# EasyEDA schematic speed_truck.json
TITLE: speed_truck; REV: 1.0; Date: 2022-02-19; Sheet: 1/1; Drawn By: Norman Karas; Company: CRISTAL
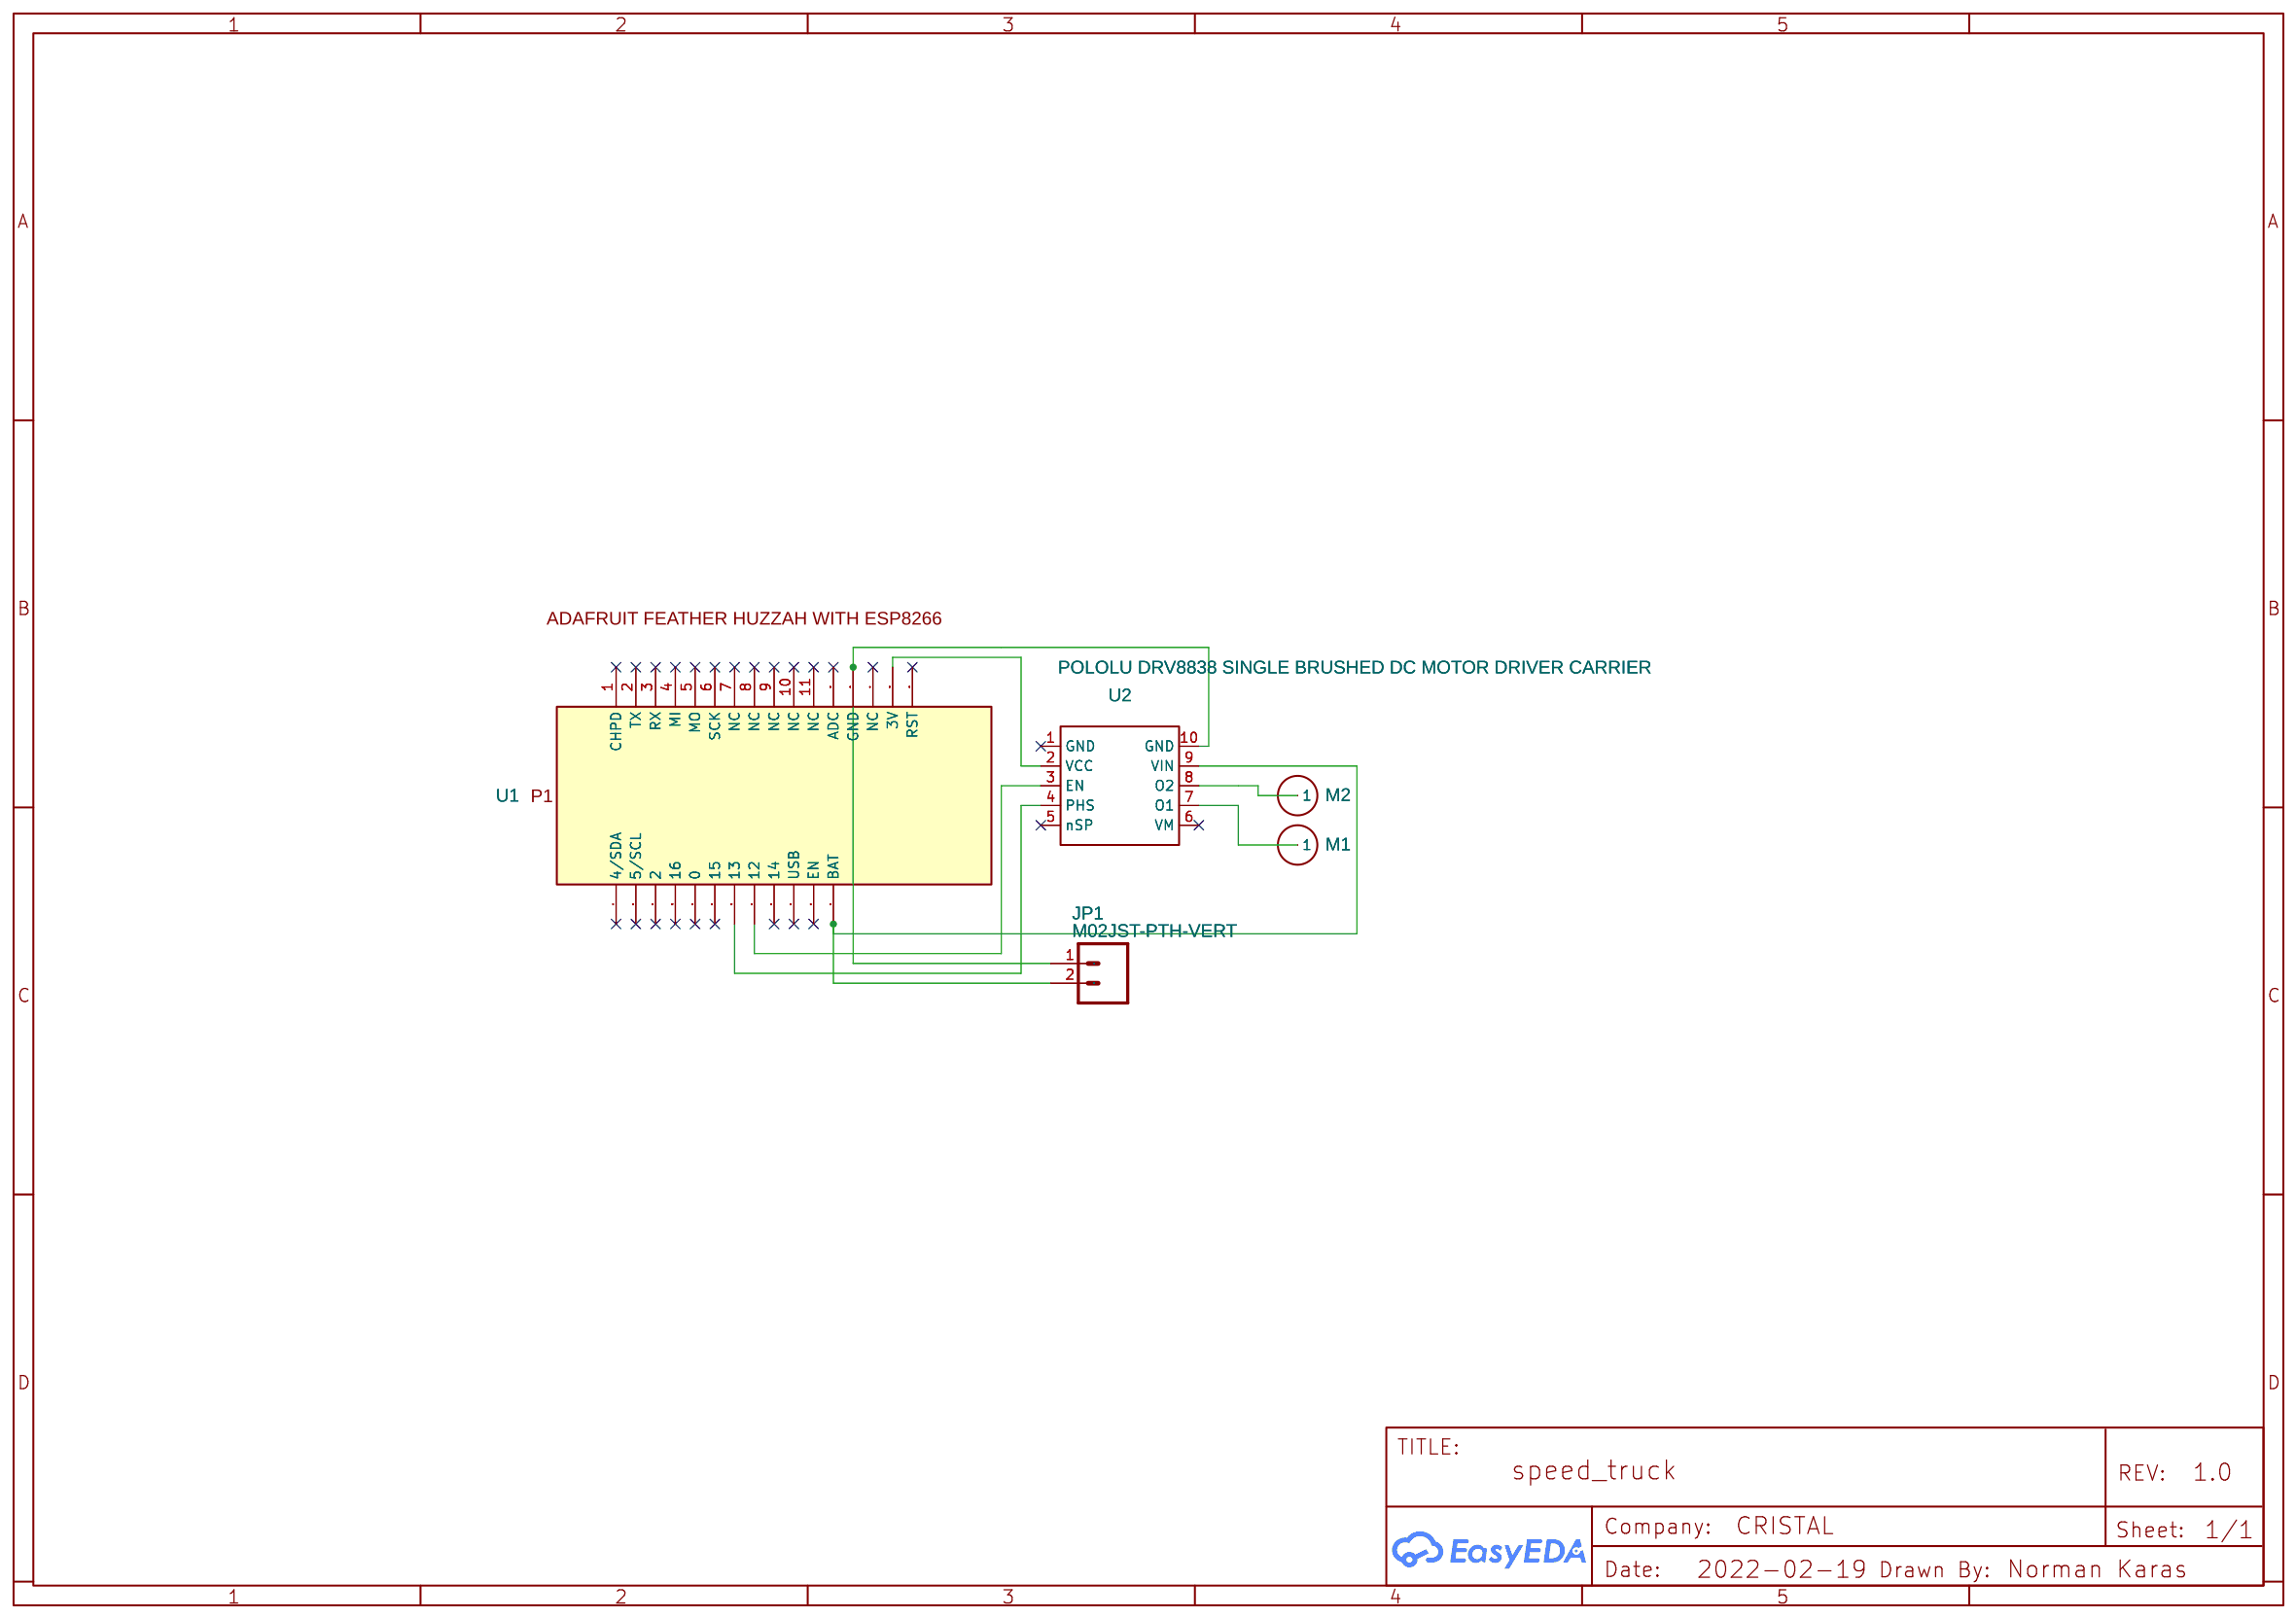
[diagram p0: schematic sheet]

## Parts
JP1  M02JST-PTH-VERT  [JST-2-PTH-VERT]
M1  Pad through hole 0.5mm hole 1mm pad  [PAD THROUGH HOLE 0.5MM HOLE 1MM PAD]
M2  Pad through hole 0.5mm hole 1mm pad  [PAD THROUGH HOLE 0.5MM HOLE 1MM PAD]
U1  Adafruit Huzzah ESP8266 - K5MAP  [ADAFRUIT HUZZAH ESP8266 - K5MAP]
U2  POLOLU DRV8838 SINGLE BRUSHED DC MOTOR DRIVER CARRIER  [POLOLU DRV8838 SINGLE BRUSHED DC MOTOR DRIVER CARRIER]

## Library data of the parts
JP1 = M02JST-PTH-VERT: Contributor: cory613
M1 M2 = Pad through hole 0.5mm hole 1mm pad: Contributor: tomack2020
U1 = Adafruit Huzzah ESP8266 - K5MAP: link: https://www.adafruit.com/product/2821; Contributor: k5map
U2 = POLOLU DRV8838 SINGLE BRUSHED DC MOTOR DRIVER CARRIER: Manufacturer: Pololu; Manufacturer Part: https://www.pololu.com/product/2990; Contributor: GameArea158

## Nets
Net-(JP1-1): JP1.1 U1.13(GND) U2.10(GND)
Net-(JP1-2): JP1.2 U1.28(BAT) U2.9(VIN)
Net-(M1-1): M1.1 U2.7(O1)
Net-(M2-1): M2.1 U2.8(O2)
Net-(U1-15): U1.15(3V) U2.2(VCC)
Net-(U1-23): U1.23(13) U2.4(PHS)
Net-(U1-24): U1.24(12) U2.3(EN)

Not connected (* = marked no-connect by the designer): U1 1(CHPD)* 2(TX)* 3(RX)* 4(MI)* 5(MO)* 6(SCK)* 7(NC)* 8(NC)* 9(NC)* 10(NC)* 11(NC)* 12(ADC)* 14(NC)* 16(RST)* 17(4/SDA)* 18(5/SCL)* 19(2)* 20(16)* 21(0)* 22(15)* 25(14)* 26(USB)* 27(EN)*; U2 1(GND)* 5(nSP)* 6(VM)*
